# Altium schematic sheet 6.STM32F103.SchDoc
size A; DocumentNumber: 6; SheetNumber: 6; SheetTotal: 6
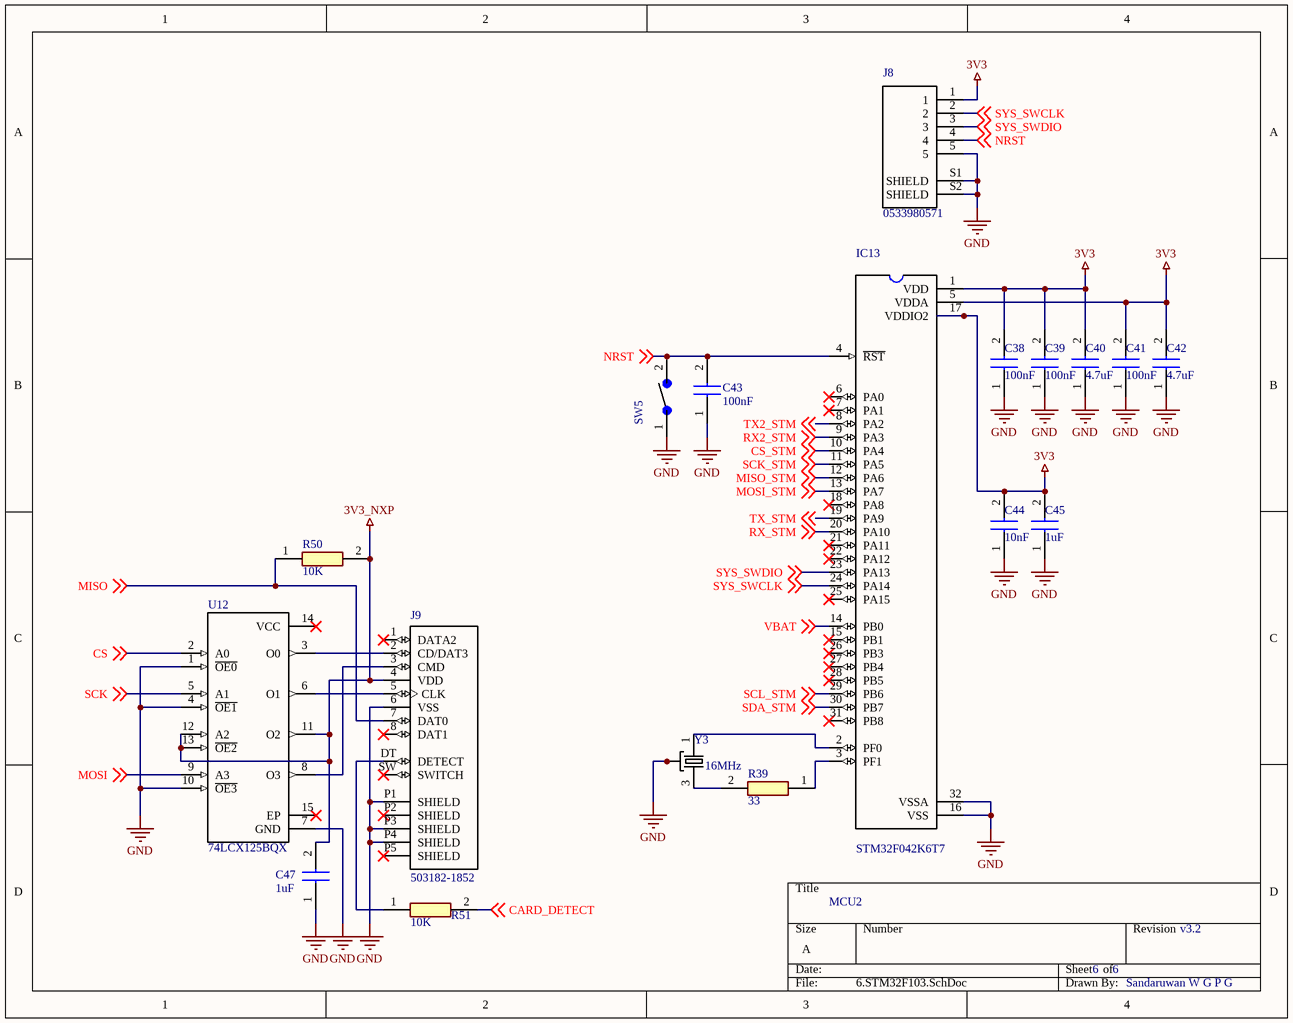
[diagram p0: 6.STM32F103.SchDoc]

## Parts
C38  value 100nF  [*CAPC1608X95N]  (hidden comment: capacitor 0603)
C39  value 100nF  [*CAPC1608X95N]  (hidden comment: capacitor 0603)
C40  value 4.7uF  [*CAPC1608X95N]  (hidden comment: capacitor 0603)
C41  value 100nF  [*CAPC1608X95N]  (hidden comment: capacitor 0603)
C42  value 4.7uF  [*CAPC1608X95N]  (hidden comment: capacitor 0603)
C43  value 100nF  [*CAPC1608X95N]  (hidden comment: capacitor 0603)
C44  value 10nF  [*CAPC1608X95N]  (hidden comment: capacitor 0603)
C45  value 1uF  [*CAPC1608X95N]  (hidden comment: capacitor 0603)
C47  value 1uF  [*CAPC1608X95N]  (hidden comment: capacitor 0603)
IC13  STM32F042K6T7  [*QFP80P900X900X160-32N]
J8  0533980571  [*MOLEX_0533980571_0533980571(Primary)]
J9  503182-1852  [*MOLEX_503182-1852_503182-1852(Primary)]
R39  value 33  [RESC1608X55N]  (hidden comment: resistor)
R50  value 10K  [RESC1608X55N]  (hidden comment: resistor)
R51  value 10K  [RESC1608X55N]  (hidden comment: resistor)
SW5  1437566-3  [*TE_FSMSM]  (value not drawn)
U12  74LCX125BQX  [*QFN50P300X250X85-15N]
Y3  value 16MHz  [*OSCCC320X250X60N]  (hidden comment: NX3225SA-12.000M-STD-CRS-2)

## Nets
3V3: C38.2 C39.2 C40.2 C41.2 C42.2 C44.2 C45.2 IC13.1(VDD) IC13.5(VDDA) IC13.17(VDDIO2) J8.1
3V3_NXP: C47.2 J9.4(VDD) R50.2 U12.11(O2) U12.12(A2) U12.13(~{OE2})
GND: C38.1 C39.1 C40.1 C41.1 C42.1 C43.1 C44.1 C45.1 C47.1 IC13.16(VSS) IC13.32(VSSA) J8.5 J8.S1(SHIELD) J8.S2(SHIELD) J9.6(VSS) J9.P1(SHIELD) J9.P3(SHIELD) J9.P4(SHIELD) SW5.1 U12.1(~{OE0}) U12.4(~{OE1}) U12.7(GND) U12.10(~{OE3}) Y3.2(GND) Y3.4(GND)
CARD_DETECT: R51.2 ; off-sheet CARD_DETECT
CS: U12.2(A0) ; off-sheet CS
CS_STM: IC13.10(PA4) ; off-sheet CS_STM
MISO: J9.7(DAT0) R50.1 ; off-sheet MISO
MISO_STM: IC13.12(PA6) ; off-sheet MISO_STM
MOSI: U12.9(A3) ; off-sheet MOSI
MOSI_STM: IC13.13(PA7) ; off-sheet MOSI_STM
NRST: C43.2 IC13.4(~{RST}) J8.4 SW5.2 ; off-sheet NRST
RX2_STM: IC13.9(PA3) ; off-sheet RX2_STM
RX_STM: IC13.20(PA10) ; off-sheet RX_STM
SCK: U12.5(A1) ; off-sheet SCK
SCK_STM: IC13.11(PA5) ; off-sheet SCK_STM
SCL_STM: IC13.29(PB6) ; off-sheet SCL_STM
SDA_STM: IC13.30(PB7) ; off-sheet SDA_STM
SYS_SWCLK: IC13.24(PA14) J8.2 ; off-sheet SYS_SWCLK
SYS_SWDIO: IC13.23(PA13) J8.3 ; off-sheet SYS_SWDIO
TX2_STM: IC13.8(PA2) ; off-sheet TX2_STM
TX_STM: IC13.19(PA9) ; off-sheet TX_STM
VBAT: IC13.14(PB0) ; off-sheet VBAT
NetIC13_2: IC13.2(PF0) Y3.1
NetIC13_3: IC13.3(PF1) R39.1
NetJ9_2: J9.2(CD/DAT3) U12.3(O0)
NetJ9_3: J9.3(CMD) U12.8(O3)
NetJ9_5: J9.5(CLK) U12.6(O1)
NetJ9_DT: J9.DT(DETECT) R51.1
NetR39_2: R39.2 Y3.3

Not connected (* = marked no-connect by the designer): IC13 6(PA0)* 7(PA1)* 15(PB1)* 18(PA8)* 21(PA11)* 22(PA12)* 25(PA15)* 26(PB3)* 27(PB4)* 28(PB5)* 31(PB8)*; J9 1(DATA2)* 8(DAT1)* P2(SHIELD)* P5(SHIELD)* SW(SWITCH)*; U12 14(VCC)* 15(EP)*

## Notes on the sheet
- MCU2
- v3.2
- Sandaruwan W G P G

## Library data of the parts
C38-C45 C47 = capacitor 0603: Capacitor
IC13 = STM32F042K6T7: Entry-level ARM Cortex-M0 USB line MCU with 32 Kbytes Flash, 48 MHz CPU, USB, CAN and CEC functions; MF: STMicroelectronics; MP: STM32F042K6T7; Package: LQFP-32 STMicroelectronics; SnapEDA_Link: https://www.snapeda.com/parts/STM32F042K6T7/STMicroelectronics/view-part/?ref=snap; Price: None; Availability: Unavailable; Value: *
J8 = 0533980571: Conn Shrouded Header HDR 5 POS 1.25mm Solder ST SMD PicoBladeÃƒÂ¢Ã¢Â€ÂžÂ¢ Embossed T/R /; MF: Molex; MP: 0533980571; Availability: Unavailable; SnapEDA_Link: https://www.snapeda.com/parts/0533980571/Molex/view-part/472893/?ref=snap; Package: None; Price: None; Value: *
J9 = 503182-1852: MICRO SD NORMAL ULTRALOWPRO8CKTE; MF: Molex; MP: 5031821852; Availability: Unavailable; Package: None; Price: None; SnapEDA_Link: https://www.snapeda.com/parts/5031821852/Molex/view-part/?ref=snap; Value: *
SW5 = FSMSM: Switch Tactile OFF _ON_ SPST Rectangular Button Gull Wing 0.05A 12VDC SMD Loose Piece; MF: TE Connectivity; Configuration_Pole-Throw: Single Pole - Single Throw; Contact_Current_Rating: 50 mA; Availability: Unavailable; Price: None; Package: None; SnapEDA_Link: https://www.snapeda.com/parts/FSMSM/TE%20Connectivity%20ALCOSWITCH%20Switches/view-part/?ref=snap; MP: FSMSM; TE_purchase_URL: https://www.te.com/usa-en/product-1437566-3.html?te_bu=Cor&te_type=disp&te_campaign=seda_glo_cor-seda-global-disp-prtnr-fy19-seda-model-bom-cta_sma-317_1&elqCampaignId=32493; Value: *
U12 = 74LCX125BQX: Buffer/Line Driver 4-CH Non-Inverting 3-ST CMOS 14-Pin DQFN EP T/R; MF: ON Semiconductor; Price: None; MP: 74LCX125BQX; Availability: Unavailable; Package: DQFN-14 Fairchild Semiconductor; SnapEDA_Link: https://www.snapeda.com/parts/74LCX125BQX/ON%20Semiconductor/view-part/?ref=snap; Value: *
Y3 = NX3225SA-12.000M-STD-CRS-2: Crystal 12.0000mhz 8pf Smd; MF: NDK America,; MP: NX3225SA-12.000M-STD-CRS-2; Price: None; SnapEDA_Link: https://www.snapeda.com/parts/NX3225SA-12.000M-STD-CRS-2/NDK%20America%2C%20Inc./view-part/?ref=snap; Availability: Unavailable; Package: SMD-4 NDK America